# Altium schematic sheet touch-24-v5.SchDoc
size A3; SPICEModelCacheRLVYLVLF: <root> / <DocumentId>RLVYLVLF</DocumentId> / <CacheFrame Number="0"> / <Model Name="qnpn" Kind="MDL"> / <Text>*QNPN / *NPN Trans Pinout: C,B,E / .MODEL QNPN NPN(IS=3.2E-16 BF=141 VAF=35 ISE=2.6 NE=1.46 CJE=1E-13 / + MJE=0.333 TF=6E-11 CJC=1E-13 CJS=2.2E-13 MJS=0.5 FC=0.67 )</Text> / </Model> / <Model Name="dtunnel1" Kind="CKT"> / <Text>*Tunnel Diode Default / *MCE 600V 50A 27.2ns default parameters / *Diode Pinout: A,K / * Parameters: / * RS:  Series resistance value / * RP:  Negative resistance value in parallel with capacitance. / * CP:   Capacitance value in parallel with negative resistance. / * LS:  Series inductance value. / * / * / .SUBCKT DTUNNEL1 1 2 PARAMS: Rs=6 Rp=-75 Cp=0.6E-12 Ls=0.1nH / RS  1 3  {Rs} / RP  3 4  {Rp} / CP  3 4  {Cp} / LS  4 2  {Ls} / .ENDS DTUNNEL1</Text> / </Model> / <Model Name="pmos" Kind="MDL"> / <Text>*Default P-Channel MOSFET / *Pinout: D,G,S / .MODEL PMOS PMOS()</Text> / </Model> / <Model Name="pnp" Kind="MDL"> / <Text>*Default PNP BJT / *PNP Trans Pinout: C,B,E / .MODEL PNP PNP()</Text> / </Model> / </CacheFrame> / </root>
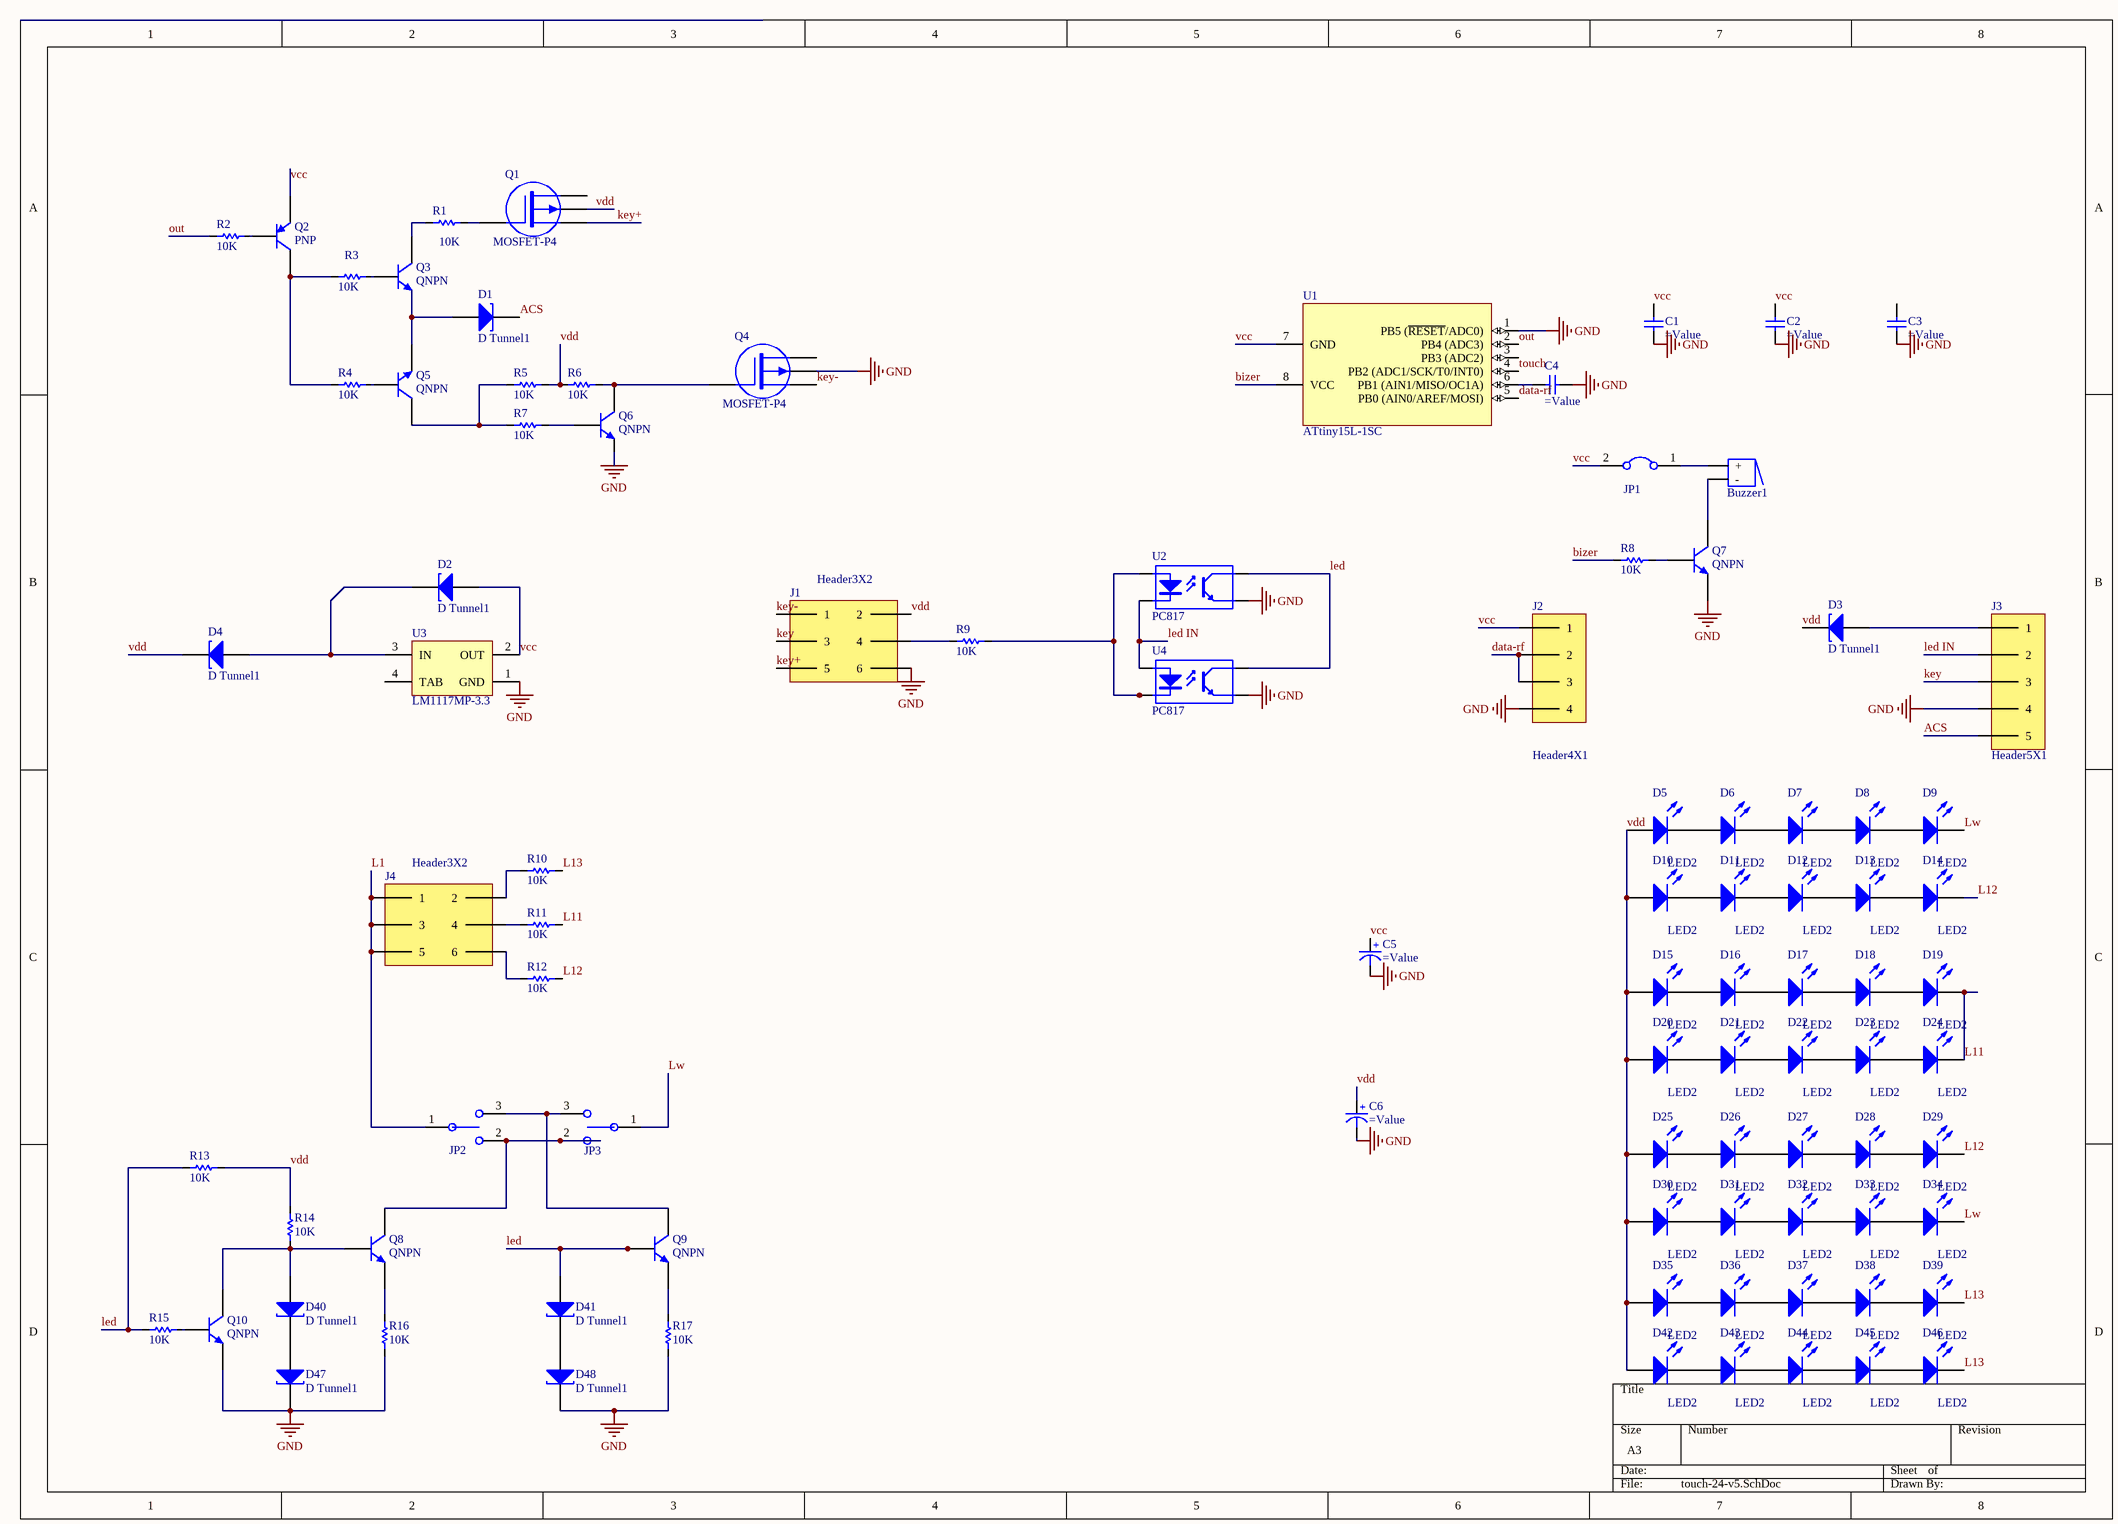
[diagram p0: touch-24-v5.SchDoc]

## Parts
Buzzer1  Buzzer  [BUZZER]  (value not drawn)
C1  (no value)  [CAP 1206]
C2  (no value)  [CAP 1206]
C3  (no value)  [CAP 1206]
C4  (no value)  [CAP 1206]
C5  (no value)  [ELEC-CAP-RAD10-20]
C6  (no value)  [ELEC-CAP-RAD15-30]
D1  D Tunnel1  [3.2X1.6X1.1]
D2  D Tunnel1  [3.2X1.6X1.1]
D3  D Tunnel1  [3.2X1.6X1.1]
D4  D Tunnel1  [3.2X1.6X1.1]
D5  LED2  [RES 0805 (2012X06L)]
D6  LED2  [RES 0805 (2012X06L)]
D7  LED2  [RES 0805 (2012X06L)]
D8  LED2  [RES 0805 (2012X06L)]
D9  LED2  [RES 0805 (2012X06L)]
D10  LED2  [RES 0805 (2012X06L)]
D11  LED2  [RES 0805 (2012X06L)]
D12  LED2  [RES 0805 (2012X06L)]
D13  LED2  [RES 0805 (2012X06L)]
D14  LED2  [RES 0805 (2012X06L)]
D15  LED2  [RES 0805 (2012X06L)]
D16  LED2  [RES 0805 (2012X06L)]
D17  LED2  [RES 0805 (2012X06L)]
D18  LED2  [RES 0805 (2012X06L)]
D19  LED2  [RES 0805 (2012X06L)]
D20  LED2  [RES 0805 (2012X06L)]
D21  LED2  [RES 0805 (2012X06L)]
D22  LED2  [RES 0805 (2012X06L)]
D23  LED2  [RES 0805 (2012X06L)]
D24  LED2  [RES 0805 (2012X06L)]
D25  LED2  [RES 0805 (2012X06L)]
D26  LED2  [RES 0805 (2012X06L)]
D27  LED2  [RES 0805 (2012X06L)]
D28  LED2  [RES 0805 (2012X06L)]
D29  LED2  [RES 0805 (2012X06L)]
D30  LED2  [RES 0805 (2012X06L)]
D31  LED2  [RES 0805 (2012X06L)]
D32  LED2  [RES 0805 (2012X06L)]
D33  LED2  [RES 0805 (2012X06L)]
D34  LED2  [RES 0805 (2012X06L)]
D35  LED2  [RES 0805 (2012X06L)]
D36  LED2  [RES 0805 (2012X06L)]
D37  LED2  [RES 0805 (2012X06L)]
D38  LED2  [RES 0805 (2012X06L)]
D39  LED2  [RES 0805 (2012X06L)]
D40  D Tunnel1  [3.2X1.6X1.1]
D41  D Tunnel1  [3.2X1.6X1.1]
D42  LED2  [RES 0805 (2012X06L)]
D43  LED2  [RES 0805 (2012X06L)]
D44  LED2  [RES 0805 (2012X06L)]
D45  LED2  [RES 0805 (2012X06L)]
D46  LED2  [RES 0805 (2012X06L)]
D47  D Tunnel1  [3.2X1.6X1.1]
D48  D Tunnel1  [3.2X1.6X1.1]
J1  Header3X2  [HEADER 3X2]
J2  Header4X1  [HEADER 4X1]
J3  Header5X1  [HEADER 5X1]
J4  Header3X2  [HEADER 3X2]
JP1  Jumper  [Header 2X1]  (value not drawn)
JP2  Jumper Selector  [Jumper Selector]  (value not drawn)
JP3  Jumper Selector  [Jumper Selector]  (value not drawn)
Q1  MOSFET-P4  [SOT223_N]
Q2  PNP  [SOT-23B_N]
Q3  QNPN  [SOT-23B_L]
Q4  MOSFET-P4  [SOT223_N]
Q5  QNPN  [SOT-23B_L]
Q6  QNPN  [SOT-23B_L]
Q7  QNPN  [SOT-23B_L]
Q8  QNPN  [SOT-23B_L]
Q9  QNPN  [SOT-23B_L]
Q10  QNPN  [SOT-23B_L]
R1  10K  [RES 1206 (3216X08L)]
R2  10K  [RES 1206 (3216X08L)]
R3  10K  [RES 1206 (3216X08L)]
R4  10K  [RES 1206 (3216X08L)]
R5  10K  [RES 1206 (3216X08L)]
R6  10K  [RES 1206 (3216X08L)]
R7  10K  [RES 1206 (3216X08L)]
R8  10K  [RES 1206 (3216X08L)]
R9  10K  [RES 1206 (3216X08L)]
R10  10K  [RES 1206 (3216X08L)]
R11  10K  [RES 1206 (3216X08L)]
R12  10K  [RES 1206 (3216X08L)]
R13  10K  [RES 1206 (3216X08L)]
R14  10K  [RES 1206 (3216X08L)]
R15  10K  [RES 1206 (3216X08L)]
R16  10K  [RES 1206 (3216X08L)]
R17  10K  [RES 1206 (3216X08L)]
U1  ATtiny15L-1SC  [8S2_N]
U2  PC817  [DIP4]
U3  LM1117MP-3.3  [SOT89L]
U4  PC817  [DIP4]

## Nets
GND: C1.1(+) C2.1(+) C3.1(+) C4.1(+) C5.1(-) C6.1(-) D47.2(K) D48.2(K) J1.6 J2.4 J3.4 Q4.3(U) Q6.3(E) Q7.3(E) Q10.3(E) R16.1 R17.1 U1.1(PB5_(~{RESET}/ADC0)) U2.3(E) U3.1(GND) U4.3(E)
ACS: D1.2(K) J3.5
bizer: R8.1 U1.8(VCC)
data-rf: J2.2 J2.3 U1.5(PB0_(AIN0/AREF/MOSI))
key: J1.3 J3.3
key+: J1.5 Q1.4(S)
key-: J1.1 Q4.4(S)
L1: J4.1 J4.3 J4.5 JP2.1
L11: D19.2(K) D24.2(K) R11.2
L12: D14.2(K) D29.2(K) R12.2
L13: D39.2(K) D46.2(K) R10.2
led: D41.1(A) Q9.2(B) R13.1 R15.1 U2.4(C) U4.4(C)
led IN: J3.2 U2.2(K) U4.1(A)
Lw: D9.2(K) D34.2(K) JP3.1
out: R2.1 U1.2(PB4_(ADC3))
touch: U1.4(PB2_(ADC1/SCK/T0/INT0))
vcc: C1.2(-) C2.2(-) C5.2(+) D2.1(A) J2.1 JP1.2 Q2.3(E) U1.7(GND) U3.2(OUT)
vdd: C6.2(+) D3.2(K) D4.2(K) D5.1(A) D10.1(A) D15.1(A) D20.1(A) D25.1(A) D30.1(A) D35.1(A) D42.1(A) J1.2 Q1.3(U) R5.2 R6.1 R13.2 R14.2
NetBuzzer1_1: Buzzer1.1(+) JP1.1
NetBuzzer1_2: Buzzer1.2(-) Q7.1(C)
NetC4_2: C4.2(-) U1.6(PB1_(AIN1/MISO/OC1A))
NetD1_1: D1.1(A) Q3.3(E) Q5.3(E)
NetD2_2: D2.2(K) D4.1(A) U3.3(IN)
NetD3_1: D3.1(A) J3.1
NetD5_2: D5.2(K) D6.1(A)
NetD6_2: D6.2(K) D7.1(A)
NetD7_2: D7.2(K) D8.1(A)
NetD8_2: D8.2(K) D9.1(A)
NetD10_2: D10.2(K) D11.1(A)
NetD11_2: D11.2(K) D12.1(A)
NetD12_2: D12.2(K) D13.1(A)
NetD13_2: D13.2(K) D14.1(A)
NetD15_2: D15.2(K) D16.1(A)
NetD16_2: D16.2(K) D17.1(A)
NetD17_2: D17.2(K) D18.1(A)
NetD18_2: D18.2(K) D19.1(A)
NetD20_2: D20.2(K) D21.1(A)
NetD21_2: D21.2(K) D22.1(A)
NetD22_2: D22.2(K) D23.1(A)
NetD23_2: D23.2(K) D24.1(A)
NetD25_2: D25.2(K) D26.1(A)
NetD26_2: D26.2(K) D27.1(A)
NetD27_2: D27.2(K) D28.1(A)
NetD28_2: D28.2(K) D29.1(A)
NetD30_2: D30.2(K) D31.1(A)
NetD31_2: D31.2(K) D32.1(A)
NetD32_2: D32.2(K) D33.1(A)
NetD33_2: D33.2(K) D34.1(A)
NetD35_2: D35.2(K) D36.1(A)
NetD36_2: D36.2(K) D37.1(A)
NetD37_2: D37.2(K) D38.1(A)
NetD38_2: D38.2(K) D39.1(A)
NetD40_1: D40.1(A) Q8.2(B) Q10.1(C) R14.1
NetD40_2: D40.2(K) D47.1(A)
NetD41_2: D41.2(K) D48.1(A)
NetD42_2: D42.2(K) D43.1(A)
NetD43_2: D43.2(K) D44.1(A)
NetD44_2: D44.2(K) D45.1(A)
NetD45_2: D45.2(K) D46.1(A)
NetJ1_4: J1.4 R9.1
NetJ4_2: J4.2 R10.1
NetJ4_4: J4.4 R11.1
NetJ4_6: J4.6 R12.1
NetJP2_2: JP2.2 JP3.2 Q8.1(C)
NetJP2_3: JP2.3 JP3.3 Q9.1(C)
NetQ1_1: Q1.1(G) R1.2
NetQ2_1: Q2.1(C) R3.1 R4.1
NetQ2_2: Q2.2(B) R2.2
NetQ3_1: Q3.1(C) R1.1
NetQ3_2: Q3.2(B) R3.2
NetQ4_1: Q4.1(G) Q6.1(C) R6.2
NetQ5_1: Q5.1(C) R5.1 R7.1
NetQ5_2: Q5.2(B) R4.2
NetQ6_2: Q6.2(B) R7.2
NetQ7_2: Q7.2(B) R8.2
NetQ8_3: Q8.3(E) R16.2
NetQ9_3: Q9.3(E) R17.2
NetQ10_2: Q10.2(B) R15.2
NetR9_2: R9.2 U2.1(A) U4.2(K)

Not connected (* = marked no-connect by the designer): C3 2(-); Q1 2(D); Q4 2(D); U1 3(PB3_(ADC2)); U3 4(TAB)

## Library data of the parts
Buzzer1 = Buzzer: Designer: Seyed Mohsen Ghasemain; ComponentLinkURL: www.picpars.com
C1-C4 = Capacitor
C5 C6 = Capacitor Electrolytic: Electrolytic Capacitor
D1-D4 D40 D41 D47 D48 = D Tunnel1: Tunnel Diode - RLC Model; Published: 8-Jun-2000; LatestRevisionDate: 17-Jul-2002; LatestRevisionNote: Re-released for DXP Platform.; PackageVersion: Feb-2002; PackageReference: 3.2X1.6X1.1; Publisher: Altium Limited; PackageDescription: SM LED; 2 Flat Leads
D5-D39 D42-D46 = LED2: Typical RED, GREEN, YELLOW, AMBER GaAs LED; Published: 8-Jun-2000; LatestRevisionDate: 17-Jul-2002; LatestRevisionNote: Re-released for DXP Platform.; PackageVersion: Feb-2002; PackageReference: 3.2X1.6X1.1; Publisher: Altium Limited; PackageDescription: SM LED; 2 Flat Leads
Q1 Q4 = MOSFET-P4: P-Channel MOSFET, Externally Terminated Substrate; Published: 24-Mar-1999; LatestRevisionDate: 29-May-2009; LatestRevisionNote: IPC-7351 Footprint Added.; PackageVersion: 2002; PackageReference: SOT223; Publisher: Altium Limited; PackageDescription: 4-Pin SOT-223 Package 2.3 mm Pitch, 7 mm Lead Span; Code_JEITA: SC-75; Code_JEDEC: TO-261-AA-B; Code_IPC: SOT223-4
Q2 = PNP: PNP Bipolar Transistor; pin to pad: 1>3 2>1 3>2; Published: 8-Jun-2000; LatestRevisionDate: 29-May-2009; LatestRevisionNote: IPC-7351 Footprint Added.; PackageVersion: Aug-1999; PackageReference: SOT-23B; Publisher: Altium Limited; PackageDescription: 3-Pin SOT-23 Package 0.95 mm Pitch, 2.4 mm Lead Span
Q3 Q5-Q10 = QNPN: NPN Bipolar Transistor; pin to pad: 1>3 2>1 3>2; Published: 8-Jun-2000; LatestRevisionDate: 29-May-2009; LatestRevisionNote: IPC-7351 Footprint Added.; PackageVersion: Aug-1999; PackageReference: SOT-23B; Publisher: Altium Limited; PackageDescription: 3-Pin SOT-23 Package 0.95 mm Pitch, 2.4 mm Lead Span
R1-R17 = Resistor: Tolerance: 5%; Power: 1/4 W; Value: 10K
U1 = ATtiny15L-1SC: 8-Bit AVR Microcontroller with 1K Byte of Flash Memory; pin to pad: 1>7 7>8 8>1; Published: 17-Sep-2003; LatestRevisionDate: 16-Oct-2006; LatestRevisionNote: IPC-7351 Footprint Added.; DatasheetVersion: 1187E-AVR-06/02; PackageVersion: revF, Apr-2008; PackageReference: 8S2; Publisher: Altium Limited; PackageDescription: 8-Lead, 0.208" Body, Plastic Small Outline Package (EIAJ); Supplier 1: Digi-Key; Supplier Part Number 1: ATTINY15L-1SC-ND; Supplier 2: Mouser; Supplier Part Number 2: 556-ATTINY15L1SC; ComponentLink1Description: Datasheet; ComponentLink1URL: http://www.atmel.com/dyn/resources/prod_documents/doc1187.pdf; ComponentLink2Description: Atmel.com Home; ComponentLink2URL: http://www.atmel.com
U2 U4 = OPTCOUPLER_01: 4-Pin Phototransistor Optocoupler
U3 = LM1117MP-3.3: 800mA Low-Dropout Linear Regulator; pin to pad: 1>2 2>1; Manufacturer: National Semiconductor; CompType: LDO IC; PackageTopMarking: XYTT*N05A; PowerWise: N; Published: 4-Dec-2008; DatasheetVersion: Apr-2006; PackageVersion: revB, Apr-2003; PackageReference: MP04A; Publisher: Altium Limited; PackageDescription: Molded SOT-223, 6.50 x 3.56 x 1.6mm Body, 4 Lead, 2.3mm Pitch; PartNumber: LM1117MP-3.3; RoHS: O; PinCount: 4; DigiKeyPartNumber: LM1117MP-3.3CT-ND; Code_JEDEC: TO-261-AA; Code_IPC: SOT223-4; ComponentLink1Description: LM1117 Datasheet; ComponentLink1URL: http://www.national.com/ds/LM/LM1117.pdf; ComponentLink2Description: LM1117 Web Page; ComponentLink2URL: http://www.national.com/pf/LM/LM1117.html; ComponentLink3Description: MP04A Package Page; ComponentLink3URL: http://www.national.com/packaging/folders/mp04a.html